# Altium project PCB_Hydra.PrjPcb
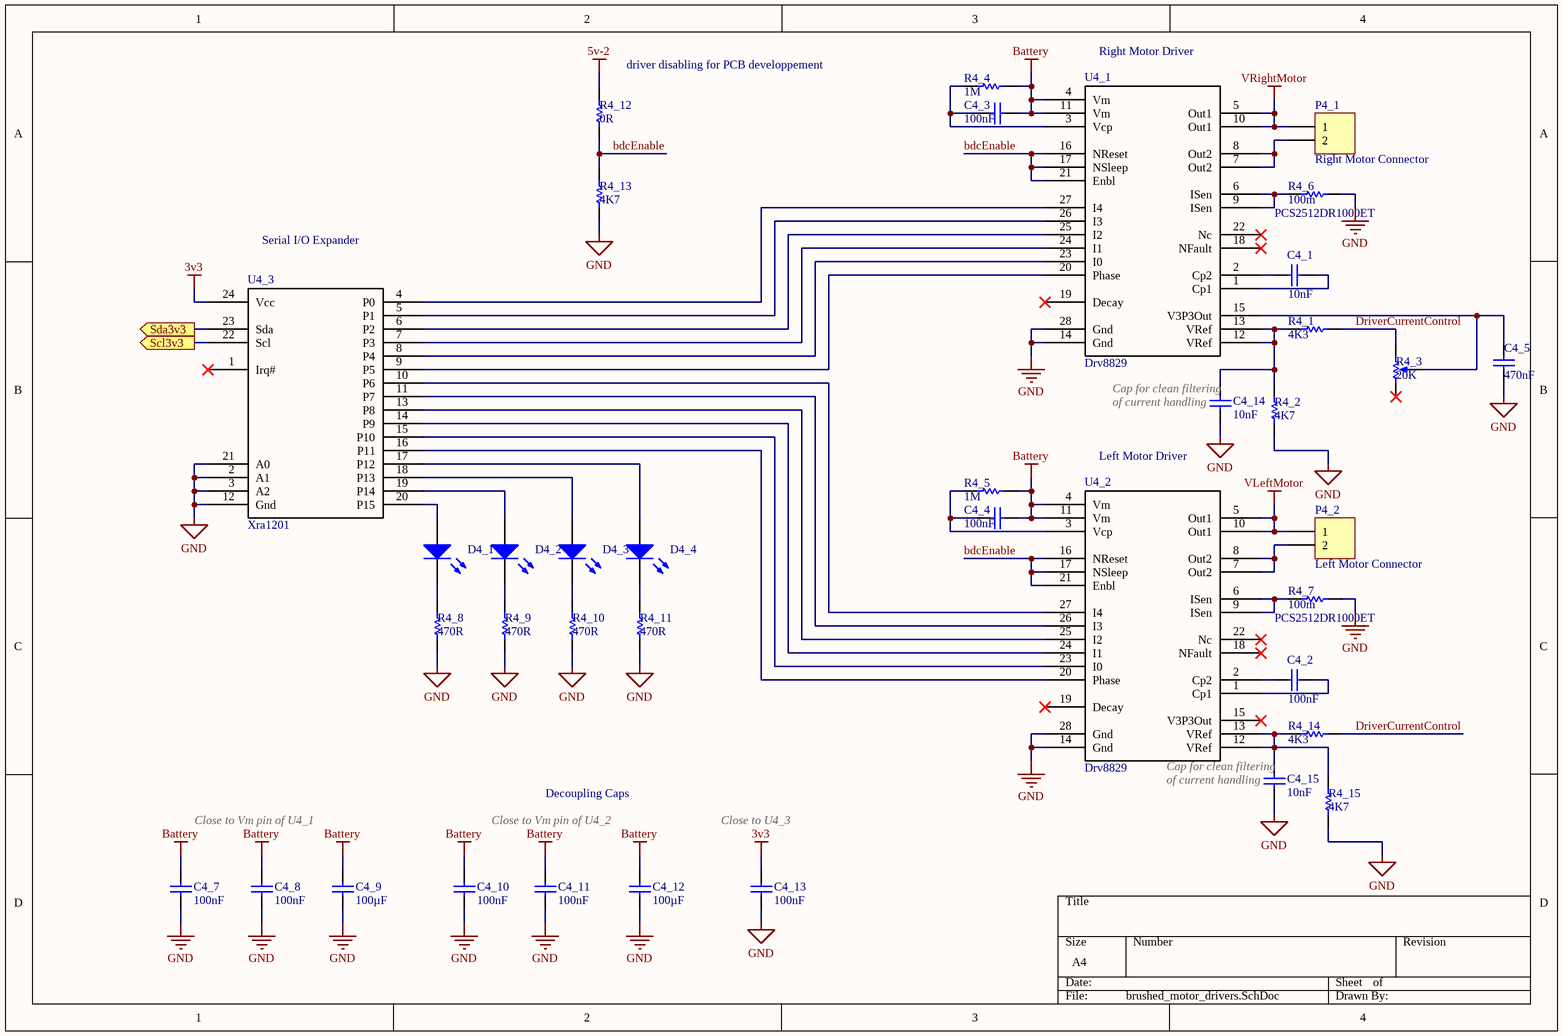
[diagram p0: brushed_motor_drivers.SchDoc]
3 sheets, 103 parts. Net scope: flat (ports and power ports of the same name join across sheets).
Board file: PCB_Alpha.PcbDoc
Sheets:
  brushed_motor_drivers.SchDoc
  main_control.SchDoc
  servo_driver_and_imu_device.SchDoc

## Sheet brushed_motor_drivers.SchDoc
size A4

### Parts
C4_1  value 10nF  [C1206]  (hidden comment: C1206C103M5RACTU)
C4_2  value 100nF  [C1206]  (hidden comment: C1206C103M5RACTU)
C4_3  value 100nF  [C1206]  (hidden comment: 12063C104MAT2A)
C4_4  value 100nF  [C1206]  (hidden comment: 12063C104MAT2A)
C4_5  value 470nF  [C1206]  (hidden comment: C1206C474M5RECAUTO)
C4_7  value 100nF  [C1206]  (hidden comment: 12063C104MAT2A)
C4_8  value 100nF  [C1206]  (hidden comment: 12063C104MAT2A)
C4_9  value 100µF  [CAP-ELECTRO-530530]  (hidden comment: 107AXZ016MQ5)
C4_10  value 100nF  [C1206]  (hidden comment: 12063C104MAT2A)
C4_11  value 100nF  [C1206]  (hidden comment: 12063C104MAT2A)
C4_12  value 100µF  [CAP-ELECTRO-530530]  (hidden comment: 107AXZ016MQ5)
C4_13  value 100nF  [C1206]  (hidden comment: 12063C104MAT2A)
C4_14  value 10nF  [C1206]  (hidden comment: C1206C103M5RACTU)
C4_15  value 10nF  [C1206]  (hidden comment: C1206C103M5RACTU)
D4_1  APT3216QBC/D  [C1206-POLARIZED]  (value not drawn)
D4_2  APT3216QBC/D  [C1206-POLARIZED]  (value not drawn)
D4_3  APT3216QBC/D  [C1206-POLARIZED]  (value not drawn)
D4_4  APT3216QBC/D  [C1206-POLARIZED]  (value not drawn)
P4_1  Right Motor Connector  [HDR1X2-42]
P4_2  Left Motor Connector  [HDR1X2-42]
R4_1  value 4K3  [C1206]  (hidden comment: Res1)
R4_2  value 4K7  [C1206]  (hidden comment: Res1)
R4_3  value 20K  [ST-32EB]  (hidden comment: ST32ETB203)
R4_4  value 1M  [C1206]  (hidden comment: Res1)
R4_5  value 1M  [C1206]  (hidden comment: Res1)
R4_6  PCS2512DR1000ET  value 100m  [2512]
R4_7  PCS2512DR1000ET  value 100m  [2512]
R4_8  value 470R  [C1206]  (hidden comment: Res1)
R4_9  value 470R  [C1206]  (hidden comment: Res1)
R4_10  value 470R  [C1206]  (hidden comment: Res1)
R4_11  value 470R  [C1206]  (hidden comment: Res1)
R4_12  value 0R  [C0805]  (hidden comment: Res1)
R4_13  value 4K7  [C1206]  (hidden comment: Res1)
R4_14  value 4K3  [C1206]  (hidden comment: Res1)
R4_15  value 4K7  [C1206]  (hidden comment: Res1)
U4_1  Drv8829  [SOP65P640X120-28N-GROUND_SINK]
U4_2  Drv8829  [SOP65P640X120-28N-GROUND_SINK]
U4_3  Xra1201  [SOP65P640X110-24N]

### Ports
Scl3v3 (out), Sda3v3 (out)

### Nets
3v3: C4_13.1 U4_3.24(Vcc)
5v-2: R4_12.1
Battery: C4_3.1 C4_4.1 C4_7.1 C4_8.1 C4_9.1 C4_10.1 C4_11.1 C4_12.1 R4_4.2 R4_5.2 U4_1.4(Vm) U4_1.11(Vm) U4_2.4(Vm) U4_2.11(Vm)
GND: C4_5.2 C4_7.2 C4_8.2 C4_9.2 C4_10.2 C4_11.2 C4_12.2 C4_13.2 C4_14.2 C4_15.2 R4_2.2 R4_6.2 R4_7.2 R4_8.2 R4_9.2 R4_10.2 R4_11.2 R4_13.2 R4_15.2 U4_1.14(Gnd) U4_1.28(Gnd) U4_2.14(Gnd) U4_2.28(Gnd) U4_3.2(A1) U4_3.3(A2) U4_3.12(Gnd) U4_3.21(A0)
VLeftMotor: P4_2.1 U4_2.5(Out1) U4_2.10(Out1)
VRightMotor: P4_1.1 U4_1.5(Out1) U4_1.10(Out1)
bdcEnable: R4_12.2 R4_13.1 U4_1.16(NReset) U4_1.17(NSleep) U4_1.21(Enbl) U4_2.16(NReset) U4_2.17(NSleep) U4_2.21(Enbl)
DriverCurrentControl: R4_1.2 R4_3.2(BOT) R4_14.2
Scl3v3: U4_3.22(Scl) ; port Scl3v3
Sda3v3: U4_3.23(Sda) ; port Sda3v3
NetC4_1_1: C4_1.1 U4_1.1(Cp1)
NetC4_1_2: C4_1.2 U4_1.2(Cp2)
NetC4_2_1: C4_2.1 U4_2.1(Cp1)
NetC4_2_2: C4_2.2 U4_2.2(Cp2)
NetC4_3_2: C4_3.2 R4_4.1 U4_1.3(Vcp)
NetC4_4_2: C4_4.2 R4_5.1 U4_2.3(Vcp)
NetC4_5_1: C4_5.1 R4_3.3(TAP) U4_1.15(V3P3Out)
NetC4_14_1: C4_14.1 R4_1.1 R4_2.1 U4_1.12(VRef) U4_1.13(VRef)
NetC4_15_1: C4_15.1 R4_14.1 R4_15.1 U4_2.12(VRef) U4_2.13(VRef)
NetD4_1_1: D4_1.1(A) U4_3.20(P15)
NetD4_1_2: D4_1.2(K) R4_8.1
NetD4_2_1: D4_2.1(A) U4_3.19(P14)
NetD4_2_2: D4_2.2(K) R4_9.1
NetD4_3_1: D4_3.1(A) U4_3.18(P13)
NetD4_3_2: D4_3.2(K) R4_10.1
NetD4_4_1: D4_4.1(A) U4_3.17(P12)
NetD4_4_2: D4_4.2(K) R4_11.1
NetP4_1_2: P4_1.2 U4_1.7(Out2) U4_1.8(Out2)
NetP4_2_2: P4_2.2 U4_2.7(Out2) U4_2.8(Out2)
NetR4_6_1: R4_6.1 U4_1.6(ISen) U4_1.9(ISen)
NetR4_7_1: R4_7.1 U4_2.6(ISen) U4_2.9(ISen)
NetU4_1_20: U4_1.20(Phase) U4_3.9(P5)
NetU4_1_23: U4_1.23(I0) U4_3.8(P4)
NetU4_1_24: U4_1.24(I1) U4_3.7(P3)
NetU4_1_25: U4_1.25(I2) U4_3.6(P2)
NetU4_1_26: U4_1.26(I3) U4_3.5(P1)
NetU4_1_27: U4_1.27(I4) U4_3.4(P0)
NetU4_2_20: U4_2.20(Phase) U4_3.16(P11)
NetU4_2_23: U4_2.23(I0) U4_3.15(P10)
NetU4_2_24: U4_2.24(I1) U4_3.14(P9)
NetU4_2_25: U4_2.25(I2) U4_3.13(P8)
NetU4_2_26: U4_2.26(I3) U4_3.11(P7)
NetU4_2_27: U4_2.27(I4) U4_3.10(P6)

Not connected (* = marked no-connect by the designer): R4_3 1(TOP)*; U4_1 18(NFault)* 19(Decay)* 22(Nc)*; U4_2 15(V3P3Out)* 18(NFault)* 19(Decay)* 22(Nc)*; U4_3 1(Irq#)*

### Notes on the sheet
- (near R4_12) driver disabling for PCB developpement
- (near U4_1) Right Motor Driver
- Serial I/O Expander
- (near C4_14) Cap for clean filtering
- (near C4_14) of current handling
- Left Motor Driver
- (near C4_15) Cap for clean filtering
- (near C4_15) of current handling
- Close to Vm pin of U4_1
- Close to Vm pin of U4_2
- Decoupling Caps
- Close to U4_3

### Library data of the parts
C4_1-C4_5 C4_7-C4_15 = Cap: Capacitor; Published: 8-Jun-2000; LatestRevisionDate: 17-Jul-2002; LatestRevisionNote: Re-released for DXP Platform.; PackageReference: RAD-0.3; Publisher: Altium Limited; PackageDescription: Radial Cap, Thru-Hole; 2 Leads; 0.3 in Pin Spacing
D4_1-D4_4 = LED0: Typical INFRARED GaAs LED; Published: 8-Jun-2000; LatestRevisionDate: 08-Jul-2005; LatestRevisionNote: Mech Layer 1 removed.; PackageReference: LED-0; Publisher: Altium Limited; PackageDescription: LED; 2 Leads
P4_1 P4_2 = Header 2: Header, 2-Pin; LatestRevisionDate: 17-Jul-2002; LatestRevisionNote: Re-released for DXP Platform.; Publisher: Altium Limited
R4_1 R4_2 R4_4-R4_15 = Res1: Resistor; Published: 8-Jun-2000; LatestRevisionDate: 17-Jul-2002; LatestRevisionNote: Re-released for DXP Platform.; PackageReference: AXIAL-0.3; Publisher: Altium Limited; PackageDescription: Axial Device, Thru-Hole; 2 Leads; 0.3 in Pin Spacing
R4_3 = RPot: Potentiometer; Sim Note: Enter the Resistance value and the set point into parameter fields.; Set Position: 0.5; Published: 8-Jun-2000; LatestRevisionDate: 17-Jul-2002; LatestRevisionNote: Re-released for DXP Platform.; PackageReference: VR5; Publisher: Altium Limited; PackageDescription: Variable Resistor, Thru-Hole; 3 Leads

## Sheet main_control.SchDoc
size A4
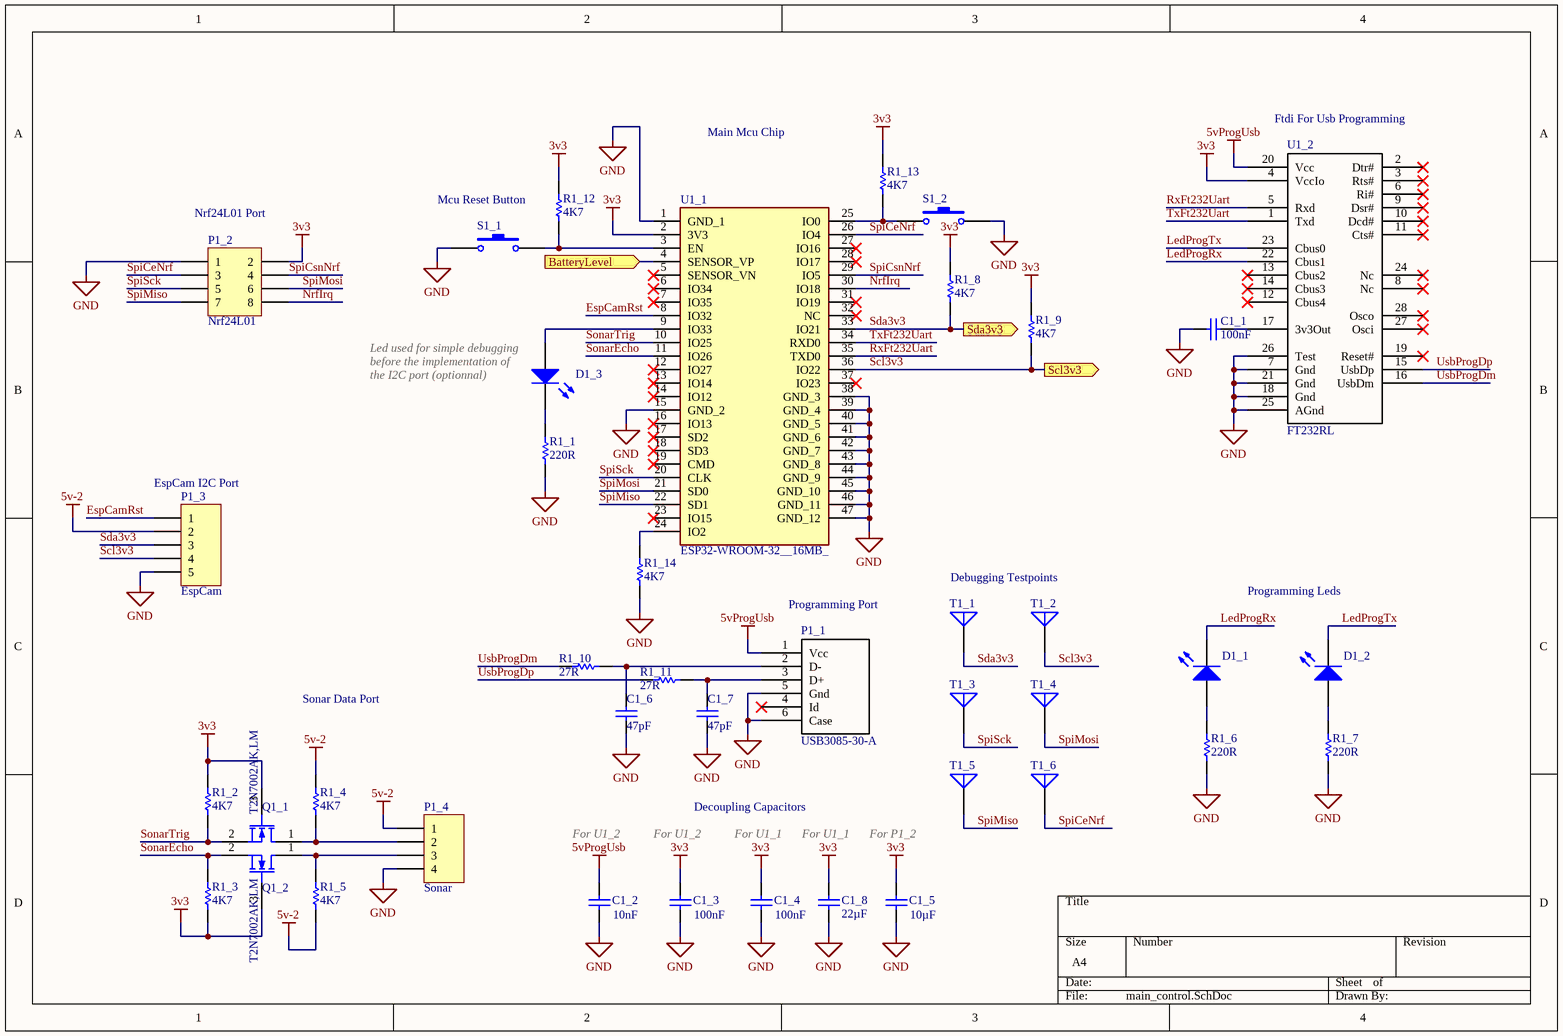
[diagram p1: main_control.SchDoc]

### Parts
C1_1  value 100nF  [C1206]  (hidden comment: 12063C104MAT2A)
C1_2  value 10nF  [C1206]  (hidden comment: C1206C103M5RACTU)
C1_3  value 100nF  [C1206]  (hidden comment: 12063C104MAT2A)
C1_4  value 100nF  [C1206]  (hidden comment: 12063C104MAT2A)
C1_5  value 10µF  [C1206]  (hidden comment: EMK316BJ106MLHT)
C1_6  value 47pF  [C1206]  (hidden comment: CML1206C0G470JT50V)
C1_7  value 47pF  [C1206]  (hidden comment: CML1206C0G470JT50V)
C1_8  value 22µF  [C1206]  (hidden comment: CL31A226KOHNNNE)
D1_1  LTST-C230KRKT  [C1206-POLARIZED]  (value not drawn)
D1_2  LTST-C230KRKT  [C1206-POLARIZED]  (value not drawn)
D1_3  APT3216QBC/D  [C1206-POLARIZED]  (value not drawn)
P1_1  USB3085-30-A  [USB-MICRO-CONNECTOR]
P1_2  Nrf24L01  [HDR2X4-42]
P1_3  EspCam  [HDR1X5-42]
P1_4  Sonar  [HDR1X4-42]
Q1_1  T2N7002AK,LM  [SOT23_L]
Q1_2  T2N7002AK,LM  [SOT23_L]
R1_1  value 220R  [C1206]  (hidden comment: Res1)
R1_2  value 4K7  [C1206]  (hidden comment: Res1)
R1_3  value 4K7  [C1206]  (hidden comment: Res1)
R1_4  value 4K7  [C1206]  (hidden comment: Res1)
R1_5  value 4K7  [C1206]  (hidden comment: Res1)
R1_6  value 220R  [C1206]  (hidden comment: Res1)
R1_7  value 220R  [C1206]  (hidden comment: Res1)
R1_8  value 4K7  [C1206]  (hidden comment: Res1)
R1_9  value 4K7  [C1206]  (hidden comment: Res1)
R1_10  value 27R  [C1206]  (hidden comment: Res1)
R1_11  value 27R  [C1206]  (hidden comment: Res1)
R1_12  value 4K7  [C1206]  (hidden comment: Res1)
R1_13  value 4K7  [C1206]  (hidden comment: Res1)
R1_14  value 4K7  [C1206]  (hidden comment: Res1)
S1_1  FSM4LPASTR  [SW4-SMT]  (value not drawn)
S1_2  FSM4LPASTR  [SW4-SMT]  (value not drawn)
T1_1  Mounting Hole  [TESTPOINT]  (value not drawn)
T1_2  Mounting Hole  [TESTPOINT]  (value not drawn)
T1_3  Mounting Hole  [TESTPOINT]  (value not drawn)
T1_4  Mounting Hole  [TESTPOINT]  (value not drawn)
T1_5  Mounting Hole  [TESTPOINT]  (value not drawn)
T1_6  Mounting Hole  [TESTPOINT]  (value not drawn)
U1_1  ESP32-WROOM-32__16MB_  [ESP32WROOM32D16MB]
U1_2  FT232RL  [SOP65P778X200-28N]

### Ports
BatteryLevel (in), Scl3v3 (out), Sda3v3 (out)

### Nets
3v3: C1_3.1 C1_4.1 C1_5.1 C1_8.1 P1_2.2 Q1_1.3(G) Q1_2.3(G) R1_2.1 R1_3.2 R1_8.1 R1_9.1 R1_12.2 R1_13.1 U1_1.2(3V3) U1_2.4(VccIo)
5v-2: P1_3.2 P1_4.1 R1_4.1 R1_5.2
5vProgUsb: C1_2.1 P1_1.1(Vcc) U1_2.20(Vcc)
GND: C1_1.2 C1_2.2 C1_3.2 C1_4.2 C1_5.2 C1_6.1 C1_7.2 C1_8.2 P1_1.5(Gnd) P1_1.6(Case) P1_2.1 P1_3.5 P1_4.4 R1_1.2 R1_6.2 R1_7.2 R1_14.2 S1_1.1 S1_2.2 U1_1.1(GND_1) U1_1.15(GND_2) U1_1.38(GND_3) U1_1.39(GND_4) U1_1.40(GND_5) U1_1.41(GND_6) U1_1.42(GND_7) U1_1.43(GND_8) U1_1.44(GND_9) U1_1.45(GND_10) U1_1.46(GND_11) U1_1.47(GND_12) U1_2.7(Gnd) U1_2.18(Gnd) U1_2.21(Gnd) U1_2.25(AGnd) U1_2.26(Test)
BatteryLevel: U1_1.4(SENSOR_VP) ; port BatteryLevel
EspCamRst: P1_3.1 U1_1.8(IO32)
LedProgRx: D1_1.2(K) U1_2.22(Cbus1)
LedProgTx: D1_2.2(K) U1_2.23(Cbus0)
NrfIrq: P1_2.8 U1_1.30(IO18)
RxFt232Uart: U1_1.35(TXD0) U1_2.5(Rxd)
Scl3v3: P1_3.4 R1_9.2 T1_2.1(A) U1_1.36(IO22) ; port Scl3v3
Sda3v3: P1_3.3 R1_8.2 T1_1.1(A) U1_1.33(IO21) ; port Sda3v3
SonarEcho: Q1_2.2(S) R1_3.1 U1_1.11(IO26)
SonarTrig: Q1_1.2(S) R1_2.2 U1_1.10(IO25)
SpiCeNrf: P1_2.3 T1_6.1(A) U1_1.26(IO4)
SpiCsnNrf: P1_2.4 U1_1.29(IO5)
SpiMiso: P1_2.7 T1_5.1(A) U1_1.22(SD1)
SpiMosi: P1_2.6 T1_4.1(A) U1_1.21(SD0)
SpiSck: P1_2.5 T1_3.1(A) U1_1.20(CLK)
TxFt232Uart: U1_1.34(RXD0) U1_2.1(Txd)
UsbProgDm: R1_10.1 U1_2.16(UsbDm)
UsbProgDp: R1_11.1 U1_2.15(UsbDp)
NetC1_1_1: C1_1.1 U1_2.17(3v3Out)
NetC1_6_2: C1_6.2 P1_1.2(D-) R1_10.2
NetC1_7_1: C1_7.1 P1_1.3(D+) R1_11.2
NetD1_1_1: D1_1.1(A) R1_6.1
NetD1_2_1: D1_2.1(A) R1_7.1
NetD1_3_1: D1_3.1(A) U1_1.9(IO33)
NetD1_3_2: D1_3.2(K) R1_1.1
NetP1_4_2: P1_4.2 Q1_1.1(D) R1_4.2
NetP1_4_3: P1_4.3 Q1_2.1(D) R1_5.1
NetR1_12_1: R1_12.1 S1_1.2 U1_1.3(EN)
NetR1_13_2: R1_13.2 S1_2.1 U1_1.25(IO0)
NetR1_14_1: R1_14.1 U1_1.24(IO2)

Not connected (* = marked no-connect by the designer): P1_1 4(Id)*; U1_1 5(SENSOR_VN)* 6(IO34)* 7(IO35)* 12(IO27)* 13(IO14)* 14(IO12)* 16(IO13)* 17(SD2)* 18(SD3)* 19(CMD)* 23(IO15)* 27(IO16)* 28(IO17)* 31(IO19)* 32(NC)* 37(IO23)*; U1_2 2(Dtr#)* 3(Rts#)* 6(Ri#)* 8(Nc)* 9(Dsr#)* 10(Dcd#)* 11(Cts#)* 12(Cbus4)* 13(Cbus2)* 14(Cbus3)* 19(Reset#)* 24(Nc)* 27(Osci)* 28(Osco)*

### Notes on the sheet
- Main Mcu Chip
- (near U1_2) Ftdi For Usb Programming
- (near P1_2) Nrf24L01 Port
- Mcu Reset Button
- (near D1_3) before the implementation of
- (near D1_3) Led used for simple debugging
- (near D1_3) the I2C port (optionnal)
- (near P1_3) EspCam I2C Port
- Debugging Testpoints
- (near P1_1) Programming Port
- Programming Leds
- Sonar Data Port
- For U1_2
- Decoupling Capacitors
- For U1_1
- For P1_2

### Library data of the parts
C1_1-C1_8 = Cap: Capacitor; Published: 8-Jun-2000; LatestRevisionDate: 17-Jul-2002; LatestRevisionNote: Re-released for DXP Platform.; PackageReference: RAD-0.3; Publisher: Altium Limited; PackageDescription: Radial Cap, Thru-Hole; 2 Leads; 0.3 in Pin Spacing
D1_1-D1_3 = LED0: Typical INFRARED GaAs LED; Published: 8-Jun-2000; LatestRevisionDate: 08-Jul-2005; LatestRevisionNote: Mech Layer 1 removed.; PackageReference: LED-0; Publisher: Altium Limited; PackageDescription: LED; 2 Leads
P1_1 = Usb Connector
P1_2 = Header 4X2: Header, 4-Pin, Dual row; LatestRevisionDate: 17-Jul-2002; LatestRevisionNote: Re-released for DXP Platform.; Publisher: Altium Limited
P1_3 = Header 5: Header, 5-Pin; LatestRevisionDate: 17-Jul-2002; LatestRevisionNote: Re-released for DXP Platform.; Publisher: Altium Limited
P1_4 = Header 4: Header, 4-Pin; LatestRevisionDate: 17-Jul-2002; LatestRevisionNote: Re-released for DXP Platform.; Publisher: Altium Limited
Q1_1 Q1_2 = MOSFET-N: N-Channel MOSFET; Published: 8-Jun-2000; LatestRevisionDate: 17-Jul-2002; LatestRevisionNote: Re-released for DXP Platform.; PackageVersion: 1995/1996; PackageReference: E3; Publisher: Altium Limited; PackageDescription: TO, Flat Index; 3 In-Line, Axial Leads; Body Dia. 4.6mm; Lead Dia. 0.5 mm (max)
R1_1-R1_14 = Res1: Resistor; Published: 8-Jun-2000; LatestRevisionDate: 17-Jul-2002; LatestRevisionNote: Re-released for DXP Platform.; PackageReference: AXIAL-0.3; Publisher: Altium Limited; PackageDescription: Axial Device, Thru-Hole; 2 Leads; 0.3 in Pin Spacing
S1_1 S1_2 = SW-PB: Switch; Published: 24-Mar-1999; LatestRevisionDate: 17-Jul-2002; LatestRevisionNote: Re-released for DXP Platform.; PackageReference: SPST-2; Publisher: Altium Limited; PackageDescription: Switch; 2 Leads
T1_1-T1_6 = Antenna: Generic Antenna; Published: 24-Mar-1999; LatestRevisionDate: 17-Jul-2002; LatestRevisionNote: Re-released for DXP Platform.; PackageReference: PIN1; Publisher: Altium Limited
U1_1 = ESP32-WROOM-32__16MB_: Integrated Circuit; Manufacturer_Name: Espressif Systems; Manufacturer_Part_Number: ESP32-WROOM-32 (16MB); Datasheet Link: https://www.espressif.com/sites/default/files/documentation/esp32_datasheet_en.pdf; Height: 3.2mm; Mouser Part Number: 356-ESPWROOM3216MB; Mouser Price/Stock: https://www.mouser.co.uk/ProductDetail/Espressif-Systems/ESP32-WROOM-32-16MB?qs=w%2Fv1CP2dgqrcPyEPuQvO1A%3D%3D
U1_2 = Ft232

## Sheet servo_driver_and_imu_device.SchDoc
size A4
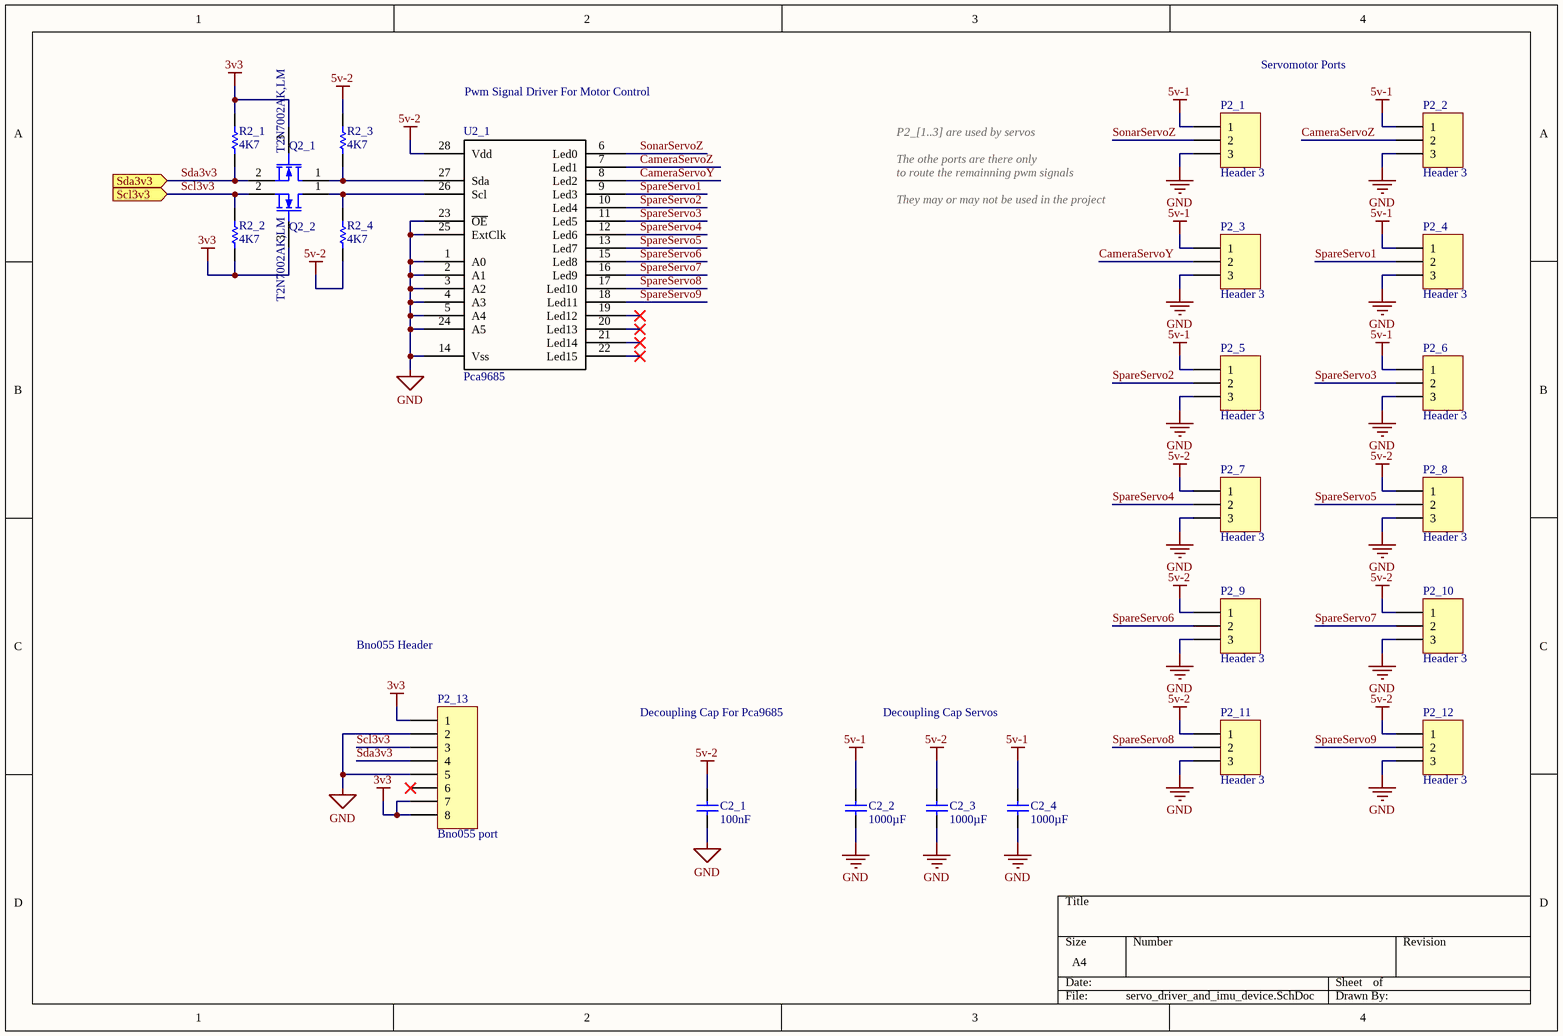
[diagram p2: servo_driver_and_imu_device.SchDoc]

### Parts
C2_1  value 100nF  [C1206]  (hidden comment: 12063C104MAT2A)
C2_2  value 1000µF  [CAP-ELECTRO-KE0]  (hidden comment: EMHS250GRA102MKE0S)
C2_3  value 1000µF  [CAP-ELECTRO-KE0]  (hidden comment: EMHS250GRA102MKE0S)
C2_4  value 1000µF  [CAP-ELECTRO-KE0]  (hidden comment: EMHS250GRA102MKE0S)
P2_1  Header 3  [HDR1X3-42]
P2_2  Header 3  [HDR1X3-42]
P2_3  Header 3  [HDR1X3-42]
P2_4  Header 3  [HDR1X3-42]
P2_5  Header 3  [HDR1X3-42]
P2_6  Header 3  [HDR1X3-42]
P2_7  Header 3  [HDR1X3-42]
P2_8  Header 3  [HDR1X3-42]
P2_9  Header 3  [HDR1X3-42]
P2_10  Header 3  [HDR1X3-42]
P2_11  Header 3  [HDR1X3-42]
P2_12  Header 3  [HDR1X3-42]
P2_13  Bno055 port  [HDR1X8-42]
Q2_1  T2N7002AK,LM  [SOT23_L]
Q2_2  T2N7002AK,LM  [SOT23_L]
R2_1  value 4K7  [C1206]  (hidden comment: Res1)
R2_2  value 4K7  [C1206]  (hidden comment: Res1)
R2_3  value 4K7  [C1206]  (hidden comment: Res1)
R2_4  value 4K7  [C1206]  (hidden comment: Res1)
U2_1  Pca9685  [SOP65P640X110-28N]

### Ports
Scl3v3 (in), Sda3v3 (in)

### Nets
3v3: P2_13.1 P2_13.7 P2_13.8 Q2_1.3(G) Q2_2.3(G) R2_1.1 R2_2.2
5v-1: C2_2.1 C2_4.1 P2_1.1 P2_2.1 P2_3.1 P2_4.1 P2_5.1 P2_6.1
5v-2: C2_1.1 C2_3.1 P2_7.1 P2_8.1 P2_9.1 P2_10.1 P2_11.1 P2_12.1 R2_3.1 R2_4.2 U2_1.28(Vdd)
GND: C2_1.2 C2_2.2 C2_3.2 C2_4.2 P2_1.3 P2_2.3 P2_3.3 P2_4.3 P2_5.3 P2_6.3 P2_7.3 P2_8.3 P2_9.3 P2_10.3 P2_11.3 P2_12.3 P2_13.2 P2_13.5 U2_1.1(A0) U2_1.2(A1) U2_1.3(A2) U2_1.4(A3) U2_1.5(A4) U2_1.14(Vss) U2_1.23(~{OE}) U2_1.24(A5) U2_1.25(ExtClk)
CameraServoY: P2_3.2 U2_1.8(Led2)
CameraServoZ: P2_2.2 U2_1.7(Led1)
Scl3v3: P2_13.3 Q2_2.2(S) R2_2.1 ; port Scl3v3
Sda3v3: P2_13.4 Q2_1.2(S) R2_1.2 ; port Sda3v3
SonarServoZ: P2_1.2 U2_1.6(Led0)
SpareServo1: P2_4.2 U2_1.9(Led3)
SpareServo2: P2_5.2 U2_1.10(Led4)
SpareServo3: P2_6.2 U2_1.11(Led5)
SpareServo4: P2_7.2 U2_1.12(Led6)
SpareServo5: P2_8.2 U2_1.13(Led7)
SpareServo6: P2_9.2 U2_1.15(Led8)
SpareServo7: P2_10.2 U2_1.16(Led9)
SpareServo8: P2_11.2 U2_1.17(Led10)
SpareServo9: P2_12.2 U2_1.18(Led11)
NetQ2_1_1: Q2_1.1(D) R2_3.2 U2_1.27(Sda)
NetQ2_2_1: Q2_2.1(D) R2_4.1 U2_1.26(Scl)

Not connected (* = marked no-connect by the designer): P2_13 6*; U2_1 19(Led12)* 20(Led13)* 21(Led14)* 22(Led15)*

### Notes on the sheet
- Pwm Signal Driver For Motor Control
- Servomotor Ports
- P2_[1..3] are used by servos
- The othe ports are there only
- to route the remainning pwm signals
- They may or may not be used in the project
- Bno055 Header
- Decoupling Cap For Pca9685
- Decoupling Cap Servos

### Library data of the parts
C2_1-C2_4 = Cap: Capacitor; Published: 8-Jun-2000; LatestRevisionDate: 17-Jul-2002; LatestRevisionNote: Re-released for DXP Platform.; PackageReference: RAD-0.3; Publisher: Altium Limited; PackageDescription: Radial Cap, Thru-Hole; 2 Leads; 0.3 in Pin Spacing
P2_1-P2_12 = Header 3: Header, 3-Pin; LatestRevisionDate: 17-Jul-2002; LatestRevisionNote: Re-released for DXP Platform.; Publisher: Altium Limited
P2_13 = Header 8: Header, 8-Pin; LatestRevisionDate: 17-Jul-2002; LatestRevisionNote: Re-released for DXP Platform.; Publisher: Altium Limited
Q2_1 Q2_2 = MOSFET-N: N-Channel MOSFET; Published: 8-Jun-2000; LatestRevisionDate: 17-Jul-2002; LatestRevisionNote: Re-released for DXP Platform.; PackageVersion: 1995/1996; PackageReference: E3; Publisher: Altium Limited; PackageDescription: TO, Flat Index; 3 In-Line, Axial Leads; Body Dia. 4.6mm; Lead Dia. 0.5 mm (max)
R2_1-R2_4 = Res1: Resistor; Published: 8-Jun-2000; LatestRevisionDate: 17-Jul-2002; LatestRevisionNote: Re-released for DXP Platform.; PackageReference: AXIAL-0.3; Publisher: Altium Limited; PackageDescription: Axial Device, Thru-Hole; 2 Leads; 0.3 in Pin Spacing
U2_1 = Pca9685: Serial pwm led driver

## Nets that join several sheets
3v3: brushed_motor_drivers (C4_13.1 U4_3.24), main_control (15 pins), servo_driver_and_imu_device (7 pins)
5v-2: brushed_motor_drivers (R4_12.1), main_control (P1_3.2 P1_4.1 R1_4.1 R1_5.2), servo_driver_and_imu_device (11 pins)
GND: brushed_motor_drivers (27 pins), main_control (36 pins), servo_driver_and_imu_device (27 pins)
Scl3v3: brushed_motor_drivers (U4_3.22), main_control (P1_3.4 R1_9.2 T1_2.1 U1_1.36), servo_driver_and_imu_device (P2_13.3 Q2_2.2 R2_2.1)
Sda3v3: brushed_motor_drivers (U4_3.23), main_control (P1_3.3 R1_8.2 T1_1.1 U1_1.33), servo_driver_and_imu_device (P2_13.4 Q2_1.2 R2_1.2)